# Altium project CAN_ESP.PrjPcb
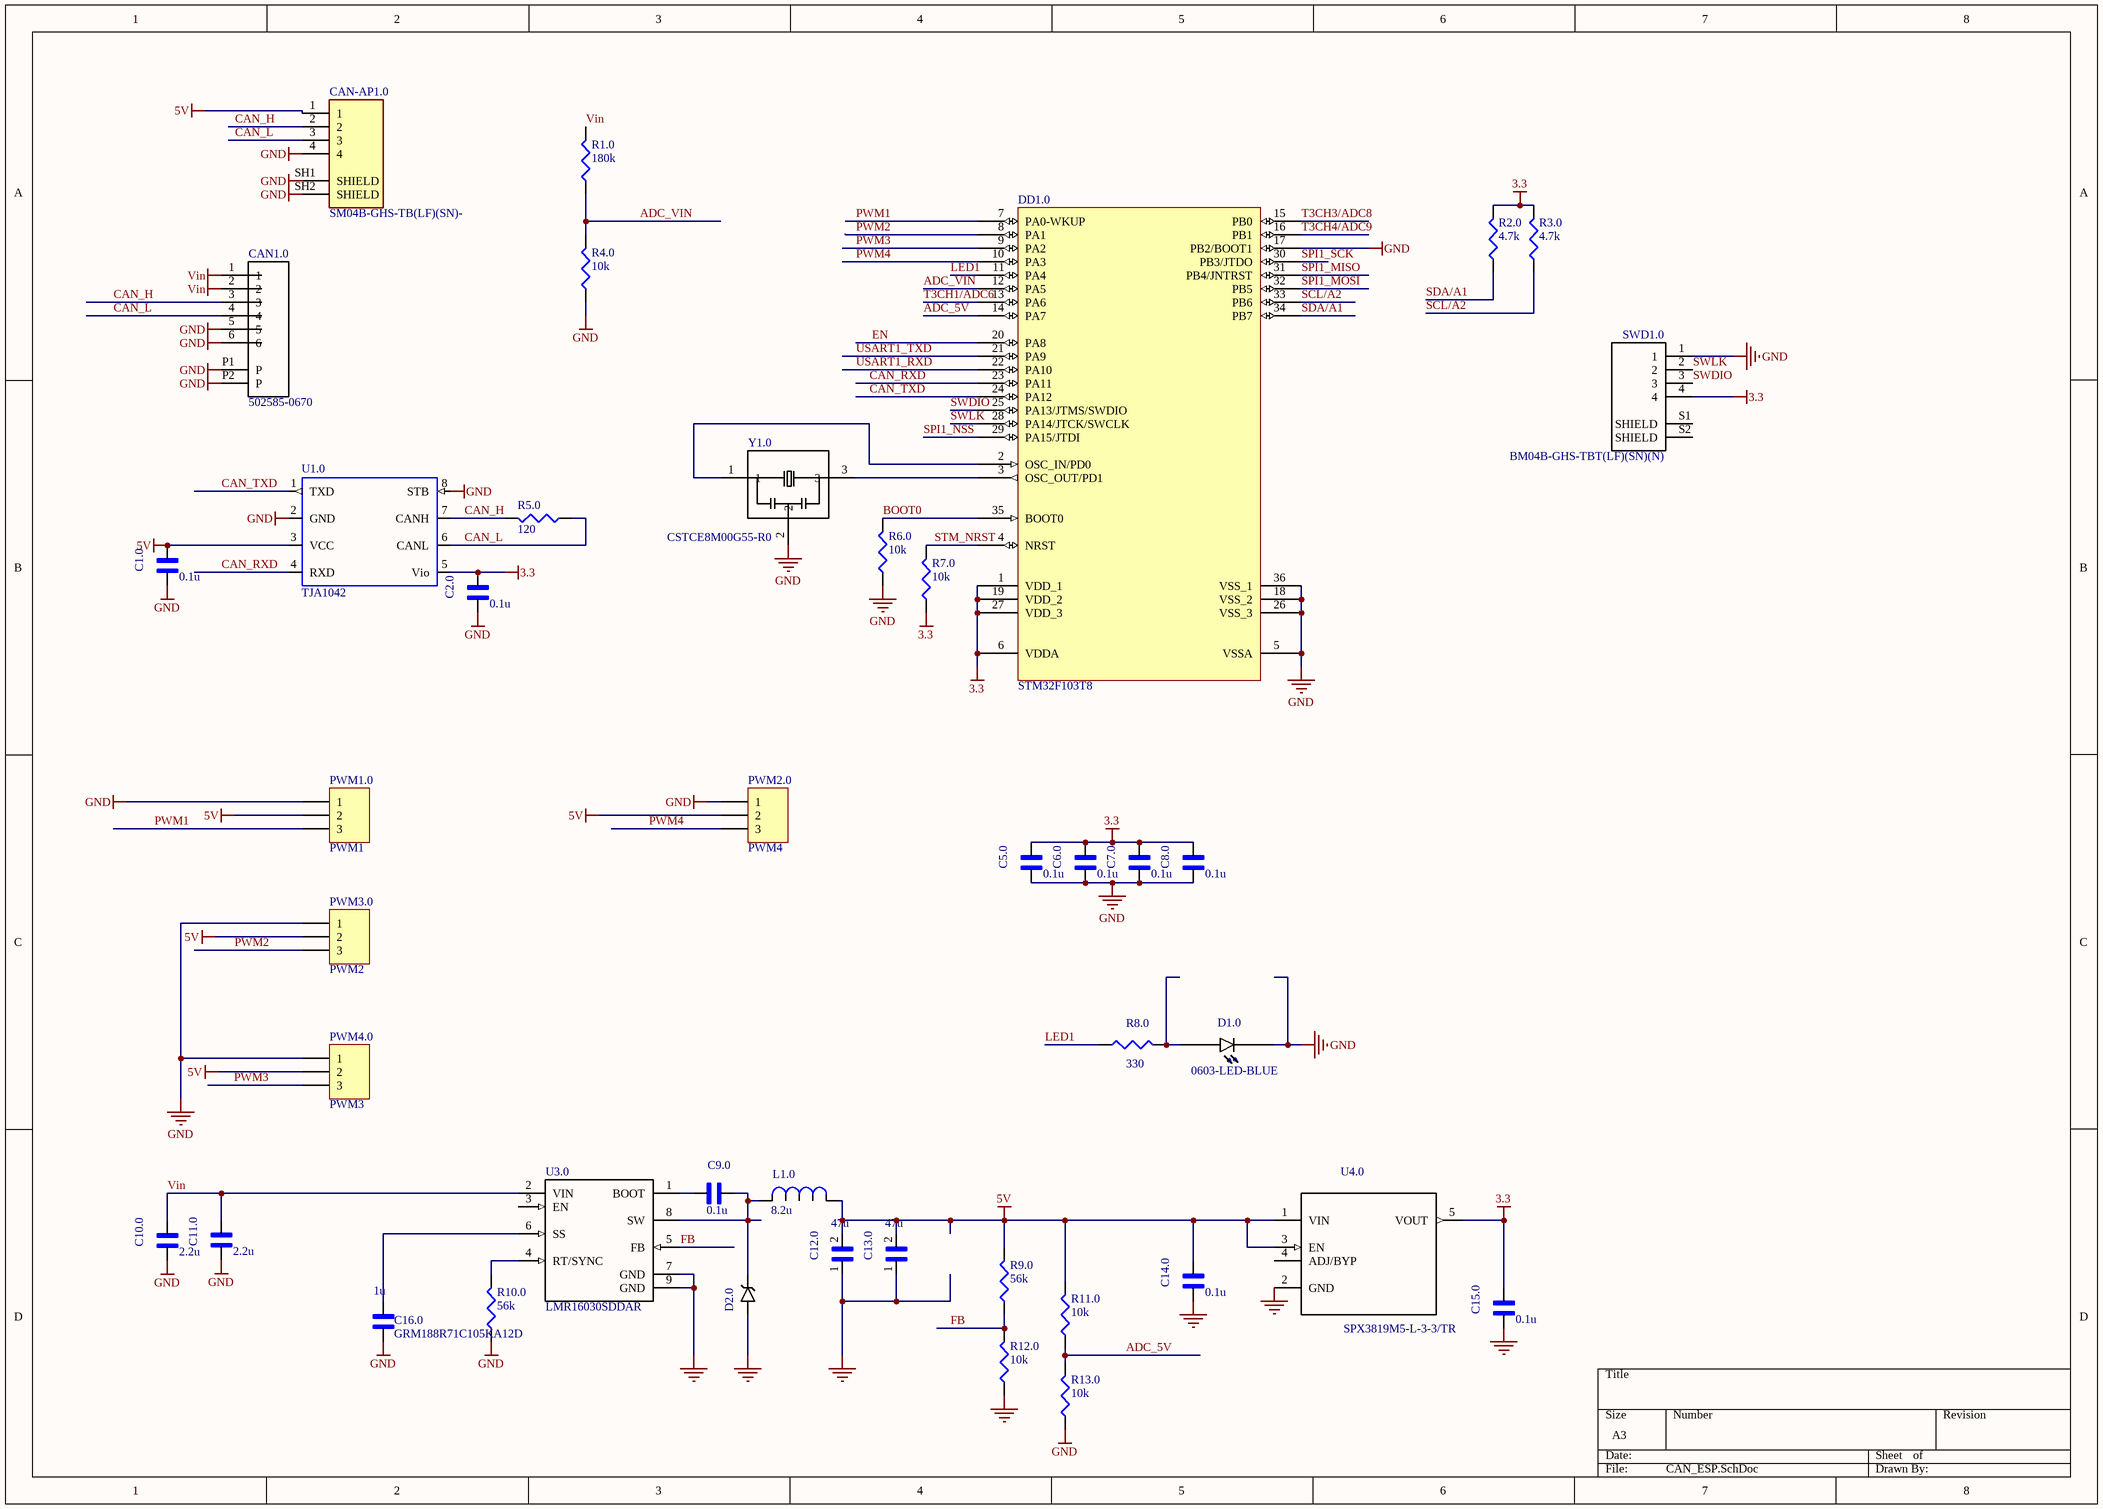
[diagram p0: CAN_ESP.SchDoc]
Version: 1; Quantity: 10
3 sheets, 81 parts. Net scope: global (net labels, ports and power ports of the same name join across sheets).
Board file: Copy of CAN_ESP.PcbDoc
Sheets:
  CAN_ESP.SchDoc
  ESP8266.SchDoc
  sESP.SchDoc

## Sheet CAN_ESP.SchDoc
size A3; Revision: 7

### Parts
C1.0  value 0.1u  [*CAPC1608X90]  (hidden comment: GX035C104MAT2-500)
C2.0  value 0.1u  [*CAPC1608X90]  (hidden comment: GX035C104MAT2-500)
C5.0  value 0.1u  [*CAPC1608X90]  (hidden comment: GX035C104MAT2-500)
C6.0  value 0.1u  [*CAPC1608X90]  (hidden comment: GX035C104MAT2-500)
C7.0  value 0.1u  [*CAPC1608X90]  (hidden comment: GX035C104MAT2-500)
C8.0  value 0.1u  [*CAPC1608X90]  (hidden comment: GX035C104MAT2-500)
C9.0  value 0.1u  [*CAPC1608X90]  (hidden comment: GX035C104MAT2-500)
C10.0  value 2.2u  [*CAP3216X125N]  (hidden comment: GRM31CR71H225KA88L)
C11.0  value 2.2u  [*CAP3216X125N]  (hidden comment: GRM31CR71H225KA88L)
C12.0  value 47u  [*CAPC3216X125N]  (hidden comment: GRM31CR61A476KE15L)
C13.0  value 47u  [*CAPC3216X125N]  (hidden comment: GRM31CR61A476KE15L)
C14.0  value 0.1u  [*CAPC1608X90]  (hidden comment: GX035C104MAT2-500)
C15.0  value 0.1u  [*CAPC1608X90]  (hidden comment: GX035C104MAT2-500)
C16.0  GRM188R71C105KA12D  value 1u  [CAPC1608X90N]
CAN1.0  502585-0670  [MOLEX_502585-0670]
CAN-AP1.0  SM04B-GHS-TB(LF)(SN)-  [JST_SM04B-GHS-TB(LF)(SN)-]
D1.0  0603-LED-BLUE  [*LEDM1608X80_LTE-C1906R-14(Primary)]
D2.0  SK56  [*SMB_P6SMB62AT3G(Primary)]  (value not drawn)
DD1.0  STM32F103T8  [*QFN50P600X600X100-37N]
L1.0  value 8.2u  [*IND_IHLP_2525_CZ]  (hidden comment: IHLP2525CZER8R2M01)
PWM1.0  PWM1  [HDR Side 3 pin]
PWM2.0  PWM4  [HDR Side 3 pin]
PWM3.0  PWM2  [HDR Side 3 pin]
PWM4.0  PWM3  [HDR Side 3 pin]
R1.0  value 180k  [J1-0603]  (hidden comment: Res3)
R2.0  value 4.7k  [J1-0603]  (hidden comment: Res3)
R3.0  value 4.7k  [J1-0603]  (hidden comment: Res3)
R4.0  value 10k  [J1-0603]  (hidden comment: Res3)
R5.0  value 120  [J1-0603]  (hidden comment: Res3)
R6.0  value 10k  [J1-0603]  (hidden comment: RC0603FR-0710KL)
R7.0  value 10k  [J1-0603]  (hidden comment: RC0603FR-0710KL)
R8.0  value 330  [J1-0603]  (hidden comment: Res3)
R9.0  value 56k  [J1-0603]  (hidden comment: Res3)
R10.0  value 56k  [J1-0603]  (hidden comment: Res3)
R11.0  value 10k  [J1-0603]  (hidden comment: RC0603FR-0710KL)
R12.0  value 10k  [J1-0603]  (hidden comment: RC0603FR-0710KL)
R13.0  value 10k  [J1-0603]  (hidden comment: RC0603FR-0710KL)
SWD1.0  BM04B-GHS-TBT(LF)(SN)(N)  [JST_BM04B-GHS-holes]
U1.0  TJA1042  [SOT782-1]
U3.0  LMR16030SDDAR  [*SOIC127P600X170-9N - duplicate]
U4.0  SPX3819M5-L-3-3/TR  [*SOT95P280X145-5N]
Y1.0  CSTCE8M00G55-R0  [*OSC_CSTCE8M00G55-R0]

### Nets
3.3: C2.0.1 C5.0.1 C6.0.1 C7.0.1 C8.0.1 C15.0.1 DD1.0.1(VDD_1) DD1.0.6(VDDA) DD1.0.19(VDD_2) DD1.0.27(VDD_3) R2.0.2 R3.0.2 R7.0.1 SWD1.0.4 U1.0.5(Vio) U4.0.5(VOUT)
5V: C1.0.1 C12.0.2 C13.0.2 C14.0.1 CAN-AP1.0.1 L1.0.1 PWM1.0.2 PWM2.0.2 PWM3.0.2 PWM4.0.2 R9.0.2 R11.0.2 U1.0.3(VCC) U4.0.1(VIN) U4.0.3(EN)
GND: C1.0.2 C2.0.2 C5.0.2 C6.0.2 C7.0.2 C8.0.2 C10.0.2 C11.0.2 C12.0.1 C13.0.1 C14.0.2 C15.0.2 C16.0.1 CAN1.0.5 CAN1.0.6 CAN1.0.P1(P) CAN1.0.P2(P) CAN-AP1.0.4 CAN-AP1.0.SH1(SHIELD) CAN-AP1.0.SH2(SHIELD) D1.0.C D2.0.A DD1.0.5(VSSA) DD1.0.17(PB2/BOOT1) DD1.0.18(VSS_2) DD1.0.26(VSS_3) DD1.0.36(VSS_1) PWM1.0.1 PWM2.0.1 PWM3.0.1 PWM4.0.1 R4.0.1 R6.0.1 R10.0.1 R12.0.1 R13.0.1 SWD1.0.1 U1.0.2(GND) U1.0.8(STB) U3.0.7(GND) U3.0.9(GND) U4.0.2(GND) Y1.0.2
Vin: C10.0.1 C11.0.1 CAN1.0.1 CAN1.0.2 R1.0.2 U3.0.2(VIN)
ADC_5V: DD1.0.14(PA7) R11.0.1 R13.0.2
ADC_VIN: DD1.0.12(PA5) R1.0.1 R4.0.2
BOOT0: DD1.0.35(BOOT0) R6.0.2
CAN_H: CAN1.0.3 CAN-AP1.0.2 R5.0.2 U1.0.7(CANH)
CAN_L: CAN1.0.4 CAN-AP1.0.3 R5.0.1 U1.0.6(CANL)
CAN_RXD: DD1.0.23(PA11) U1.0.4(RXD)
CAN_TXD: DD1.0.24(PA12) U1.0.1(TXD)
EN: DD1.0.20(PA8)
FB: R9.0.1 R12.0.2 U3.0.5(FB)
LED1: DD1.0.11(PA4) R8.0.1
PWM1: DD1.0.7(PA0-WKUP) PWM1.0.3
PWM2: DD1.0.8(PA1) PWM3.0.3
PWM3: DD1.0.9(PA2) PWM4.0.3
PWM4: DD1.0.10(PA3) PWM2.0.3
SCL/A2: DD1.0.33(PB6) R3.0.1
SDA/A1: DD1.0.34(PB7) R2.0.1
SPI1_MISO: DD1.0.31(PB4/JNTRST)
SPI1_MOSI: DD1.0.32(PB5)
SPI1_NSS: DD1.0.29(PA15/JTDI)
SPI1_SCK: DD1.0.30(PB3/JTDO)
STM_NRST: DD1.0.4(NRST) R7.0.2
SWDIO: DD1.0.25(PA13/JTMS/SWDIO) SWD1.0.3
SWLK: DD1.0.28(PA14/JTCK/SWCLK) SWD1.0.2
T3CH1/ADC6: DD1.0.13(PA6)
T3CH3/ADC8: DD1.0.15(PB0)
T3CH4/ADC9: DD1.0.16(PB1)
USART1_RXD: DD1.0.22(PA10)  [project net TXD0]
USART1_TXD: DD1.0.21(PA9)  [project net RXD0]
NetC9.0_1: C9.0.1 D2.0.C L1.0.2 U3.0.8(SW)
NetC9.0_2: C9.0.2 U3.0.1(BOOT)
NetC16.0_2: C16.0.2 U3.0.6(SS)
NetD1.0_A: D1.0.A R8.0.2
NetDD1.0_2: DD1.0.2(OSC_IN/PD0) Y1.0.1
NetDD1.0_3: DD1.0.3(OSC_OUT/PD1) Y1.0.3
NetR10.0_2: R10.0.2 U3.0.4(RT/SYNC)

Not connected (* = marked no-connect by the designer): SWD1.0 S1(SHIELD) S2(SHIELD); U3.0 3(EN); U4.0 4(ADJ/BYP)

### Library data of the parts
C1.0 C2.0 C5.0 C6.0 C7.0 C8.0 C9.0 = GX035C104MAT2-500: Cap Thin Film 0.1uf 50v 0603; MF: AVX; MP: GX035C104MAT2-500 or CL10B104JB8NNNC; Pacage Metric: 1608; Type: SMD; Package: 0603 AVX; SnapEDA_Link: https://www.snapeda.com/parts/GX035C104MAT2-500/AVX/view-part/?ref=snap
C10.0 C11.0 = GRM31CR71H225KA88L: / 1206 2.2 uF 50 V В±10% Tolerance X7R SMT Multilayer Ceramic Capacitor /; MF: Murata Electronics; Type: SMD; Package: 1206 Murata; SnapEDA_Link: https://www.snapeda.com/parts/GRM31CR71H225KA88L/Murata%20Electronics%20North%20America/view-part/?ref=snap; MP: GRM31CR71H225KA88L
C12.0 C13.0 = GRM31CR61A476KE15L: Multilayer Ceramic Capacitor, GRM Series, 47 - F, - 10%, X5R, 10 V, 1206 [3216 Metric]; MF: Murata Electronics; Type: SMD; Package: 1206 Murata Electronics; MP: GRM31CR61A476KE15L; SnapEDA_Link: https://www.snapeda.com/parts/GRM31CR61A476KE15L/Murata%20Electronics%20North%20America/view-part/?ref=snap
C14.0 C15.0 = GX035C104MAT2-500: Cap Thin Film 0.1uf 50v 0603; MF: AVX; Pacage Metric: 1608; Type: SMD; Package: 0603 AVX; MP: GX035C104MAT2-500; SnapEDA_Link: https://www.snapeda.com/parts/GX035C104MAT2-500/AVX/view-part/?ref=snap
C16.0 = GRM188R71C105KA12D: SMD Capacitor X7R(EIA) with Capacitance: 1.0uF Tol. 10%. Rated Voltage: 16Vdc; MF: Murata Electronics; Pacage Metric: 1608; MP: GRM188R71C105KA12D; SnapEDA_Link: https://www.snapeda.com/parts/GRM188R71C105KA12D/Murata%20Electronics%20North%20America/view-part/228340/?ref=snap; Package: 0603; ChipDip_Link: https://www.chipdip.ru/product/grm188r71c105ka12d; HelpURL: https://static.chipdip.ru/lib/428/DOC005428493.pdf; Type: SMD
CAN1.0 = 502585-0670: 1.50mm Pitch, CLIK-Mate PCB Receptacle, Single Row, Surface Mount, Right-Angle, Tin Plating, Positive Lock, 6 Circuits, Natural; MF: Molex; System: Connector; MP: 502585-0670; Package: None; SnapEDA_Link: https://www.snapeda.com/parts/502494-0670/Molex/view-part/?ref=snap; Value: *; Type: SMD
CAN-AP1.0 = SM04B-GHS-TB(LF)(SN)-: Connector Header Surface Mount, Right Angle 4 position 0.049 _1.25mm_; MF: JST Sales; MP: SM04B-GHS-TB(LF)(SN); Package: None; Value: *; SnapEDA_Link: https://www.snapeda.com/parts/SM04B-GHS-TB%28LF%29%28SN%29-/JST%20Sales%20America%20Inc./view-part/2759740/?ref=snap; HelpURL: http://www.farnell.com/datasheets/2082975.pdf; System: Connector; ChipDip_Link: https://www.chipdip.ru/product/sm04b-ghs-tb-lf-sn-gh-1.25mm-header-side-ent
D1.0 = LTE-C1906R-14: LED IrLED Chip LED 2-Pin SMD T/R; Package: 0603 Lite-On; MP: 0603-LED-BLUE; SnapEDA_Link: https://www.snapeda.com/parts/LTE-C1906R-14/Lite-On%20Inc./view-part/?ref=snap; Value: *; Type: SMD
D2.0 = SK56: Диод Шоттки 5А 60В [SMB / DO-214AA]; MF: Littelfuse Inc.; Type: SMD; MP: SK56; Package: DO-214 Littelfuse; SnapEDA_Link: https://www.snapeda.com/parts/P6SMB62AT3G/Littelfuse%20Inc./view-part/?ref=snap; Value: *; ChipDip_Link: https://www.chipdip.ru/product/sk56
DD1.0 = STM32F103T8: STM32F103T8U6, Микроконтроллер 32BIT ARM 64K FLASH [VFQFPN-36]; MF: STM; ChipDip_Link: https://www.chipdip.ru/product/stm32f103t8u6-2; HelpURL: http://www.st.com/stonline/products/literature/ds/13587.pdf; MP: STM32F103T8U6; Package: VFQFPN-36; SnapEDA_Link: https://www.snapeda.com/parts/STM32F103T8U6TR/STMicroelectronics/view-part/?ref=search&t=STM32F103T8U6; Type: SMD
L1.0 = IHLP2525CZER8R2M01: IHLP2525CZER8R2M01, 8.2uH 4A 20% Low Profile High Current SMT Inductor, Индуктивность; MF: Vishay Dale; Price: None; Availability: Unavailable; SnapEDA_Link: https://www.snapeda.com/parts/IHLP2525CZER100M01/Vishay%20Dale/view-part/?ref=snap; MP: IHLP2525CZER8R2M01; Package: Nonstandard Vishay
PWM1.0 PWM2.0 PWM3.0 PWM4.0 = Header 3: Header, 4-Pin; System: Connector; MF: Connfly electronic (Zhenqin); MP: PLS-3 (DS1021-1x3); Type: SMD; ChipDip_Link: https://www.chipdip.ru/product/pls-3; HelpURL: https://static.chipdip.ru/lib/227/DOC000227157.pdf
R1.0 = Res3: Resistor; Pacage Metric: 1608; MP: 180K 1% 0603; Package: R0603; Type: SMD
R2.0 R3.0 = Res3: Resistor; Pacage Metric: 1608; MP: 4.7K 1% 0603; ChipDip_Link: https://www.chipdip.ru/product0/9000079736; HelpURL: https://www.chipdip.ru/product0/9000079736; Package: R0603; Type: SMD
R4.0 = Res3: Resistor; Pacage Metric: 1608; MP: 10K 1% 0603; ChipDip_Link: https://www.chipdip.ru/product0/9000079736; HelpURL: https://www.chipdip.ru/product0/9000079736; Package: R0603; Type: SMD
R5.0 = Res3: 120 Ohms 1 0.1 W 1 10 W Chip Resistor 0603 1608 Metric Thick Film; Pacage Metric: 1608; MP: RC0603FR-07120RL; ChipDip_Link: https://www.chipdip.ru/product0/9000079618; HelpURL: https://www.chipdip.ru/product0/9000079618; Package: R0603; Type: SMD
R6.0 R7.0 R11.0 R12.0 R13.0 = RC0603FR-0710KL: 10 kOhms 1 0.1 W 1 10 W Chip Resistor 0603 1608 Metric Thick Film; Pacage Metric: 1608; MF: Yageo or NXP; MP: 10K 1% 0603; ChipDip_Link: https://www.chipdip.ru/product0/9000079736; HelpURL: https://www.chipdip.ru/product0/9000079736; Package: R0603; Type: SMD; SnapEDA_Link: https://www.snapeda.com/parts/RC0603FR-0710KL/Yageo/view-part/?ref=dk&t=RC0603FR-0710KL&con_ref=None
R8.0 = Res3: Resistor; Pacage Metric: 1608; MP: RC0603FR-07330RL; ChipDip_Link: https://www.chipdip.ru/product0/9000079628; HelpURL: https://www.chipdip.ru/product0/9000079628; Package: R0603; Type: SMD
R9.0 R10.0 = Res3: Resistor; Pacage Metric: 1608; MP: RC0603FR-0756KL; ChipDip_Link: https://www.chipdip.ru/product0/9000079754; HelpURL: https://www.chipdip.ru/product0/9000079754; Package: R0603; Type: SMD
SWD1.0 = BM04B-GHS-TBT(LF)(SN)(N): Conn Shrouded Header HDR 4 POS 1.25mm Solder ST SMD Reel; MF: JST Sales; MP: SM04B-GHS-TB(LF)(SN); Instructions: Do not install; System: Connector; SnapEDA_Link: https://www.snapeda.com/parts/BM04B-GHS-TBT%28LF%29%28SN%29%28N%29/JST%20Sales%20America%20Inc./view-part/?ref=snap; Package: None; Value: *; Type: SMD
U1.0 = TJA1042: 1/1 Transceiver Half CANbus 8-SO; MF: NXP USA; SnapEDA_Link: https://www.snapeda.com/parts/TJA1042/NXP%20USA%20Inc./view-part/900919/?ref=snap; Value: *; MP: TJA1042; Package: VDFN-8 NXP USA; ChipDip_Link: https://www.chipdip.ru/product1/8002840332; HelpURL: https://static.chipdip.ru/lib/583/DOC001583059.pdf; Type: SMD
U3.0 = LMR16030SDDAR: LMR16030SDDAR, Conv DC-DC 4.3V to 60V Step Down Single-Out 1V to 50V 3A Automotive 8-Pin HSOP EP T/R; MF: Texas Instruments; SnapEDA_Link: https://www.snapeda.com/parts/TPS54560DDA/Texas%20Instruments/view-part/?ref=snap; MP: LMR16030SDDAR; Package: PowerSOIC-8 Texas Instruments; Value: *; Type: SMD; ChipDip_Link: https://www.chipdip.ru/product1/8003448566; HelpURL: https://www.ti.com/lit/ds/symlink/lmr16030.pdf
U4.0 = SPX3819M5-L: Low Dropout Voltage Regulator, Adjustable 0.5A, В±1%, 2.5 to 16 Vin, 5-Pin SOT-23 /; MF: MaxLinear, Inc.; Value: 3V3; MP: SPX3819M5-L-3-3/TR; Package: SOT-23-5 Exar; SnapEDA_Link: https://www.snapeda.com/parts/SPX3819M5-L/MaxLinear%2C%20Inc./view-part/?ref=snap; Type: SMD; ChipDip_Link: https://www.chipdip.ru/product1/8003455237; HelpURL: http://www.farnell.com/datasheets/2614478.pdf
Y1.0 = CSTCE8M00G55-R0: Ceramic Resonator 8MHz ??0.5% _Tol_ ??0.2% _Stability_ 33pF 40Ohm 3-Pin CSMD T/R; MF: Murata; MP: CSTCE8M00G55-R0; Package: SMD-3 Murata; SnapEDA_Link: https://www.snapeda.com/parts/CSTCE8M00G55-R0/Murata%20Electronics%20North%20America/view-part/?ref=snap; Value: *; ChipDip_Link: https://www.chipdip.ru/product1/8001783721; HelpURL: https://www.murata.com/en-eu/api/pdfdownloadapi?cate=&partno=CSTCE8M00G55-R0; Type: SMD

## Sheet ESP8266.SchDoc
size A3; Revision: 7
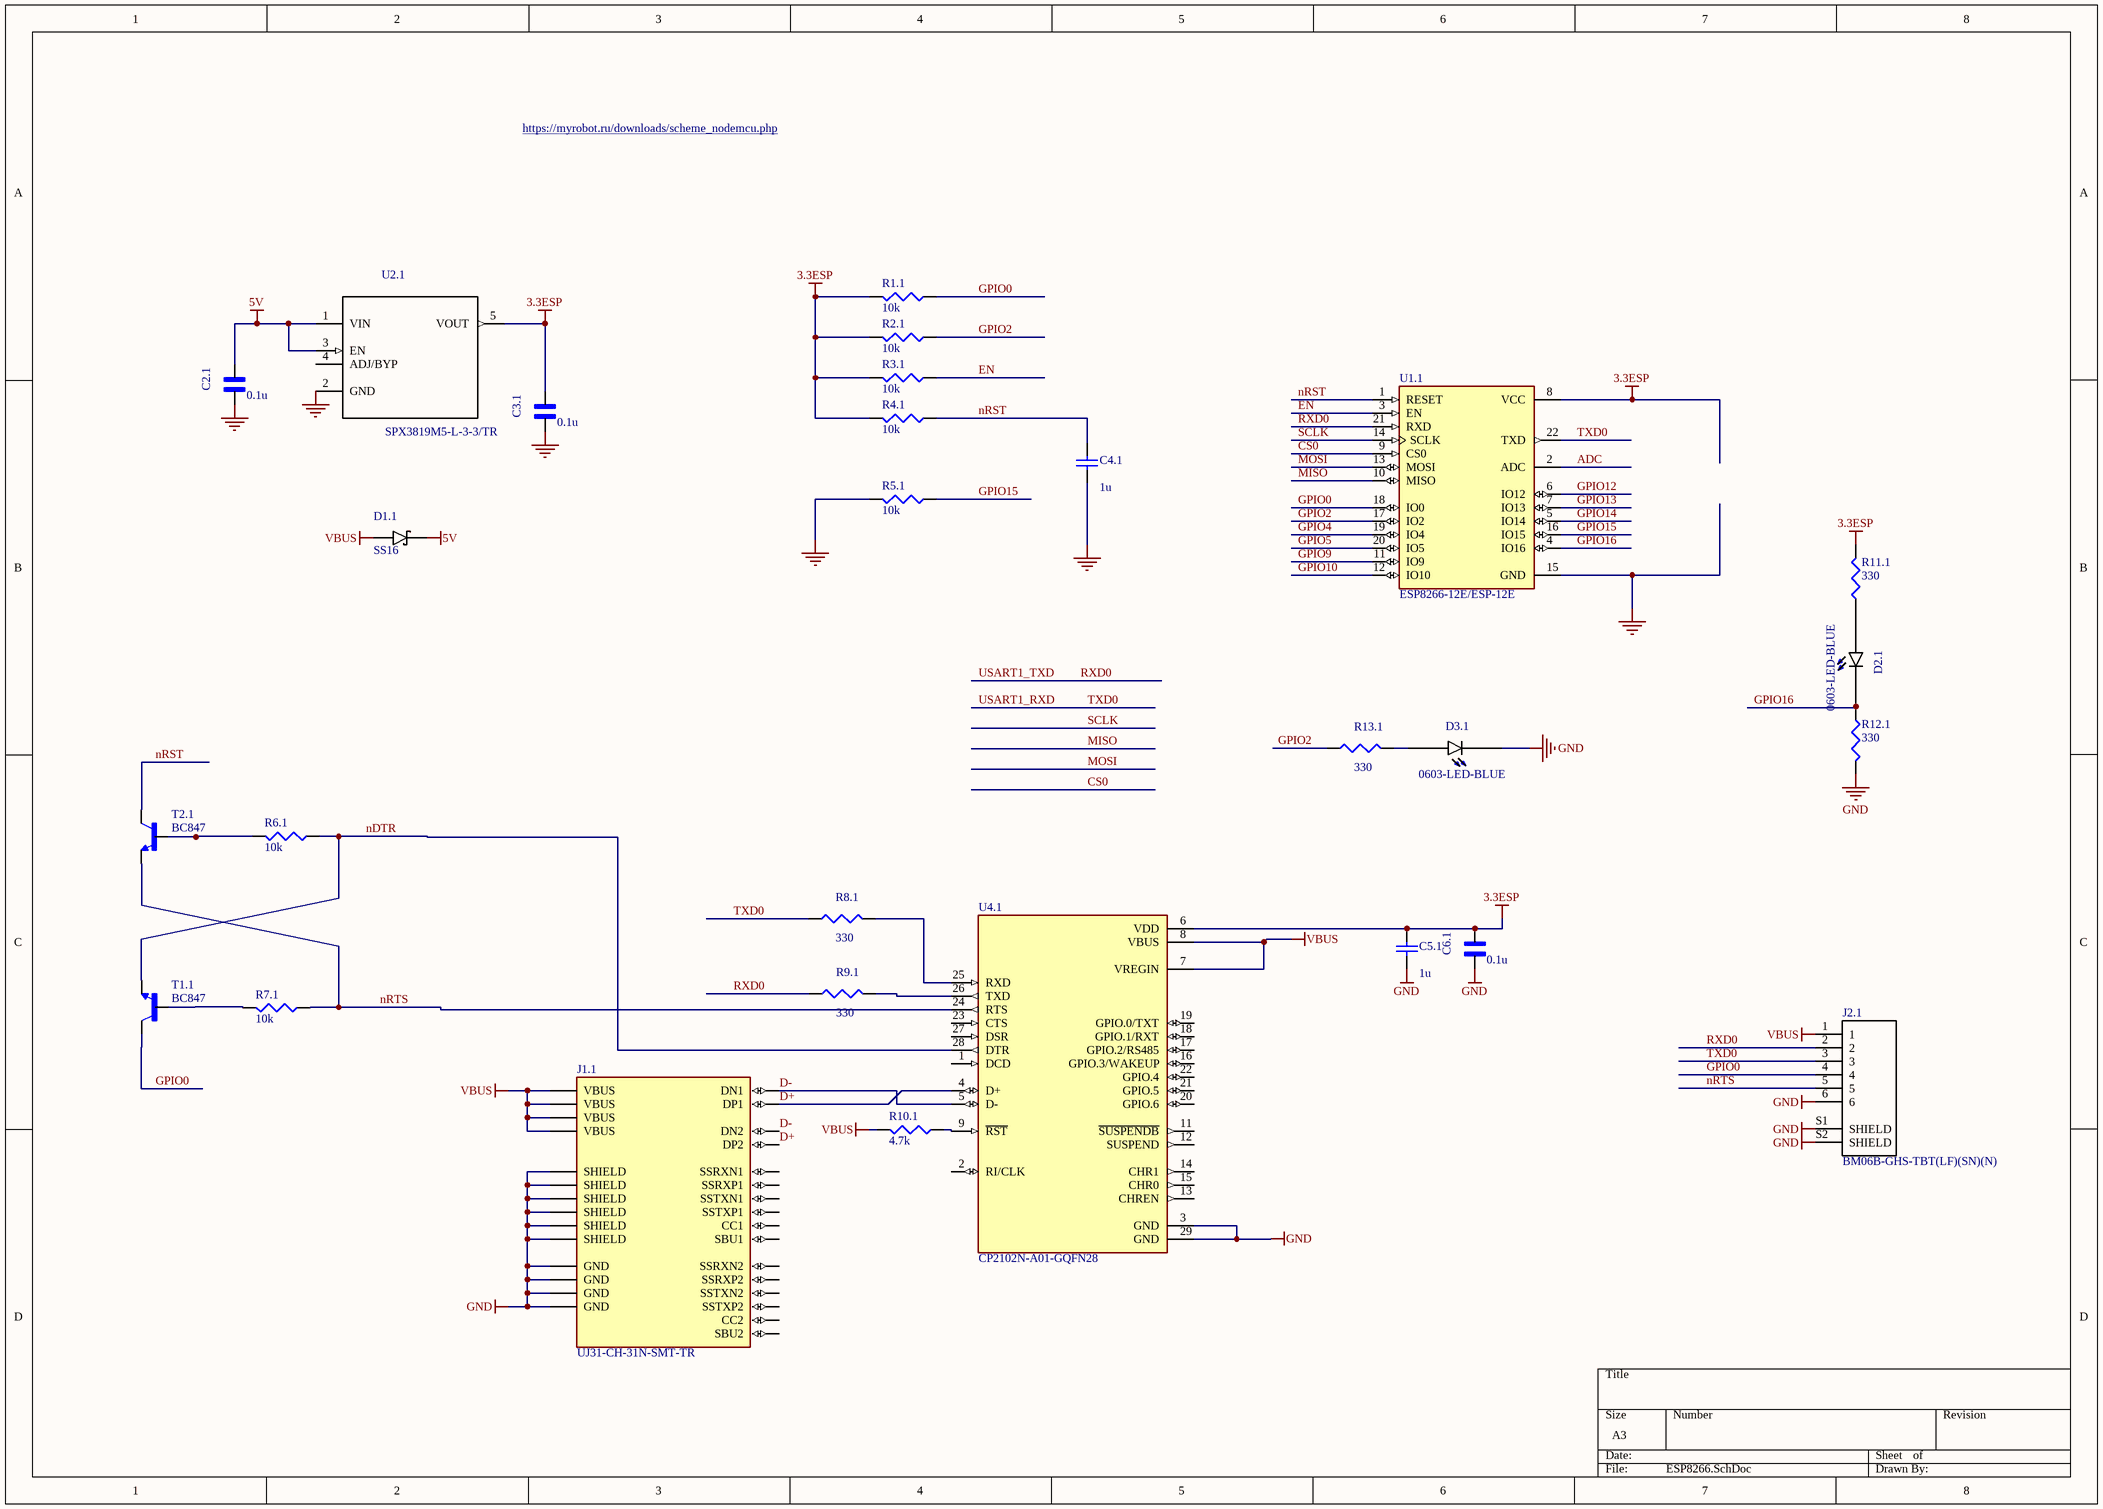
[diagram p1: ESP8266.SchDoc]

### Parts
C2.1  value 0.1u  [*CAPC1608X90]  (hidden comment: GX035C104MAT2-500)
C3.1  value 0.1u  [*CAPC1608X90]  (hidden comment: GX035C104MAT2-500)
C4.1  value 1u  [1608[0603]]  (hidden comment: Cap Semi)
C5.1  value 1u  [1608[0603]]  (hidden comment: Cap Semi)
C6.1  value 0.1u  [*CAPC1608X90]  (hidden comment: GX035C104MAT2-500)
D1.1  SS16  [*DIOM5227X250N_SS16(Primary)]
D2.1  0603-LED-BLUE  [*LEDM1608X80_LTE-C1906R-14(Primary)]
D3.1  0603-LED-BLUE  [*LEDM1608X80_LTE-C1906R-14(Primary)]
J1.1  UJ31-CH-31N-SMT-TR  [CUI_UJ31-CH-31N-SMT-TR]
J2.1  BM06B-GHS-TBT(LF)(SN)(N)  [*JST_BM06B-GHS-TBT(LF)(SN)(N)_BM06B-GHS-TBT(LF)(SN)(N)(Primary)]
R1.1  value 10k  [J1-0603]  (hidden comment: Res3)
R2.1  value 10k  [J1-0603]  (hidden comment: Res3)
R3.1  value 10k  [J1-0603]  (hidden comment: Res3)
R4.1  value 10k  [J1-0603]  (hidden comment: Res3)
R5.1  value 10k  [J1-0603]  (hidden comment: Res3)
R6.1  value 10k  [J1-0603]  (hidden comment: Res3)
R7.1  value 10k  [J1-0603]  (hidden comment: Res3)
R8.1  value 330  [J1-0603]  (hidden comment: Res3)
R9.1  value 330  [J1-0603]  (hidden comment: Res3)
R10.1  value 4.7k  [J1-0603]  (hidden comment: Res3)
R11.1  value 330  [J1-0603]  (hidden comment: Res3)
R12.1  value 330  [J1-0603]  (hidden comment: Res3)
R13.1  value 330  [J1-0603]  (hidden comment: Res3)
T1.1  BC847  [SOT23]
T2.1  BC847  [SOT23]
U1.1  ESP8266-12E/ESP-12E  [XCVR_ESP8266-12E/ESP-12E]
U2.1  SPX3819M5-L-3-3/TR  [*SOT95P280X145-5N]
U4.1  CP2102N-A01-GQFN28  [QFN50P500X500X80-29N]

### Nets
3.3ESP: C3.1.1 C5.1.1 C6.1.1 R1.1.2 R2.1.2 R3.1.2 R4.1.2 R11.1.2 U1.1.8(VCC) U2.1.5(VOUT) U4.1.6(VDD)
5V: C2.1.1 D1.1.C(K) U2.1.1(VIN) U2.1.3(EN)
GND: C2.1.2 C3.1.2 C4.1.2 C5.1.2 C6.1.2 D3.1.C J1.1.A1(GND) J1.1.A12(GND) J1.1.B1(GND) J1.1.B12(GND) J1.1.SH1(SHIELD) J1.1.SH2(SHIELD) J1.1.SH3(SHIELD) J1.1.SH4(SHIELD) J1.1.SH5(SHIELD) J1.1.SH6(SHIELD) J2.1.6 J2.1.S1(SHIELD) J2.1.S2(SHIELD) R5.1.2 R12.1.2 U1.1.15(GND) U2.1.2(GND) U4.1.3(GND) U4.1.29(GND)
VBUS: D1.1.A J1.1.A4(VBUS) J1.1.A9(VBUS) J1.1.B4(VBUS) J1.1.B9(VBUS) J2.1.1 R10.1.2 U4.1.7(VREGIN) U4.1.8(VBUS)
ADC: U1.1.2(ADC)
CS0: U1.1.9(CS0)
D+: J1.1.A6(DP1) J1.1.B6(DP2) U4.1.4(D+)
D-: J1.1.A7(DN1) J1.1.B7(DN2) U4.1.5(D-)
EN: R3.1.1 U1.1.3(EN)
GPIO0: J2.1.4 R1.1.1 T1.1.3(C) U1.1.18(IO0)
GPIO2: R2.1.1 R13.1.1 U1.1.17(IO2)
GPIO4: U1.1.19(IO4)
GPIO5: U1.1.20(IO5)
GPIO9: U1.1.11(IO9)
GPIO10: U1.1.12(IO10)
GPIO12: U1.1.6(IO12)
GPIO13: U1.1.7(IO13)
GPIO14: U1.1.5(IO14)
GPIO15: R5.1.1 U1.1.16(IO15)
GPIO16: D2.1.C R12.1.1 U1.1.4(IO16)
MISO: U1.1.10(MISO)
MOSI: U1.1.13(MOSI)
nDTR: R6.1.1 T1.1.2(E) U4.1.28(DTR)
nRST: C4.1.1 R4.1.1 T2.1.3(C) U1.1.1(RESET)
nRTS: J2.1.5 R7.1.1 T2.1.2(E) U4.1.24(RTS)
RXD0: J2.1.2 R9.1.1 U1.1.21(RXD)  [also labelled USART1_TXD]
SCLK: U1.1.14(SCLK)
TXD0: J2.1.3 R8.1.1 U1.1.22(TXD)  [also labelled USART1_RXD]
NetD2.1_A: D2.1.A R11.1.1
NetD3.1_A: D3.1.A R13.1.2
NetR6.1_2: R6.1.2 T2.1.1(B)
NetR7.1_2: R7.1.2 T1.1.1(B)
NetR8.1_2: R8.1.2 U4.1.25(RXD)
NetR9.1_2: R9.1.2 U4.1.26(TXD)
NetR10.1_1: R10.1.1 U4.1.9(~{RST})

Not connected (* = marked no-connect by the designer): J1.1 A2(SSTXP1) A3(SSTXN1) A5(CC1) A8(SBU1) A10(SSRXN2) A11(SSRXP2) B2(SSTXP2) B3(SSTXN2) B5(CC2) B8(SBU2) B10(SSRXN1) B11(SSRXP1); U2.1 4(ADJ/BYP); U4.1 1(DCD) 2(RI/CLK) 11(~{SUSPENDB}) 12(SUSPEND) 13(CHREN) 14(CHR1) 15(CHR0) 16(GPIO.3/WAKEUP) 17(GPIO.2/RS485) 18(GPIO.1/RXT) 19(GPIO.0/TXT) 20(GPIO.6) 21(GPIO.5) 22(GPIO.4) 23(CTS) 27(DSR)

### Notes on the sheet
- https://myrobot.ru/downloads/scheme_nodemcu.php

### Library data of the parts
C2.1 C3.1 = GX035C104MAT2-500: as C14.0 on sheet CAN_ESP; Package: 0603 AVX; MP: GX035C104MAT2-500; SnapEDA_Link: https://www.snapeda.com/parts/GX035C104MAT2-500/AVX/view-part/?ref=snap
C4.1 C5.1 = Cap Semi: Capacitor (Semiconductor SIM Model); Published: 8-Jun-2000; LatestRevisionDate: 29-May-2009; LatestRevisionNote: IPC-7351 Footprint Added.; PackageReference: C1206; Publisher: Altium Limited; PackageDescription: Chip Capacitor
C6.1 = GX035C104MAT2-500: as C1.0 on sheet CAN_ESP; Package: 0603 AVX; SnapEDA_Link: https://www.snapeda.com/parts/GX035C104MAT2-500/AVX/view-part/?ref=snap
D1.1 = SS16: Diode Schottky 60V 1A Surface Mount SMA; Type: SMD; SnapEDA_Link: https://www.snapeda.com/parts/SS16/ON%20Semiconductor/view-part/?ref=search&t=ss16; Value: *; ChipDip_Link: https://www.chipdip.ru/product/ss16; MP: SS16; Package: SMA-2
D2.1 D3.1 = LTE-C1906R-14: LED IrLED Chip LED 2-Pin SMD T/R; Package: 0603 Lite-On; MP: 0603-LED-BLUE; SnapEDA_Link: https://www.snapeda.com/parts/LTE-C1906R-14/Lite-On%20Inc./view-part/?ref=snap; Value: *; Type: SMD
J1.1 = UJ31-CH-31N-SMT-TR: Type C, USB 3.1 Gen 2, 5 A, Right Angle, Surface Mount _SMT_, USB Receptacle; MF: CUI Devices; Value: *; SnapEDA_Link: https://www.snapeda.com/parts/UJ31-CH-31N-SMT-TR/CUI%20Devices/view-part/2776725/?ref=snap; Availability: Unavailable; Price: None; Package: None; MP: UJ31-CH-31N-SMT-TR; ChipDip_Link: https://www.chipdip.ru/product1/8002862225; HelpURL: https://www.chipdip.ru/product1/8002862225
J2.1 = BM06B-GHS-TBT(LF)(SN)(N): Conn Header Gh Top 6pos 1.25mm; MP: BM06B-GHS-TBT_LF__SN__N_; MF: JST Sales; Package: None; Availability: Unavailable; SnapEDA_Link: https://www.snapeda.com/parts/BM06B-GHS-TBT%28LF%29%28SN%29%28N%29/JST%20Sales%20America%20Inc./view-part/?ref=snap; Price: None; Value: *
R1.1 R2.1 R3.1 R4.1 R5.1 R6.1 R7.1 = Res3: as R4.0 on sheet CAN_ESP; ChipDip_Link: https://www.chipdip.ru/product0/9000079736; HelpURL: https://www.chipdip.ru/product0/9000079736; Package: R0603; Type: SMD
R8.1 R9.1 R11.1 R12.1 R13.1 = Res3: as R8.0 on sheet CAN_ESP; ChipDip_Link: https://www.chipdip.ru/product0/9000079628; HelpURL: https://www.chipdip.ru/product0/9000079628; Package: R0603; Type: SMD
R10.1 = Res3: as R2.0 on sheet CAN_ESP; ChipDip_Link: https://www.chipdip.ru/product0/9000079736; HelpURL: https://www.chipdip.ru/product0/9000079736; Package: R0603; Type: SMD
T1.1 T2.1 = BC847: <b>NPN TRANSISTOR</b>; MF: {'manufacturer': u'Rectron'}; Package: None; MP: BC847; Value: *; Availability: Unavailable; Price: None
U1.1 = ESP8266-12E/ESP-12E: ESP-12E WiFi Module; MF: {'manufacturer': u'AI-Thinker'}; Price: None; MP: ESP8266-12E/ESP-12E; Availability: Unavailable; Value: *; Package: None
U2.1 = SPX3819M5-L: as U4.0 on sheet CAN_ESP; MP: SPX3819M5-L-3-3/TR; Package: SOT-23-5 Exar; SnapEDA_Link: https://www.snapeda.com/parts/SPX3819M5-L/MaxLinear%2C%20Inc./view-part/?ref=snap; Type: SMD; ChipDip_Link: https://www.chipdip.ru/product1/8003455237; HelpURL: http://www.farnell.com/datasheets/2614478.pdf
U4.1 = CP2102N-A01-GQFN28: Ic Bridge Usb To Uart 28qfn; MF: {'manufacturer': u'Silicon Labs'}; MP: CP2102N-A01-GQFN28; Value: *; Package: None; Price: None; Availability: Unavailable

## Sheet sESP.SchDoc
size A3; Revision: 7
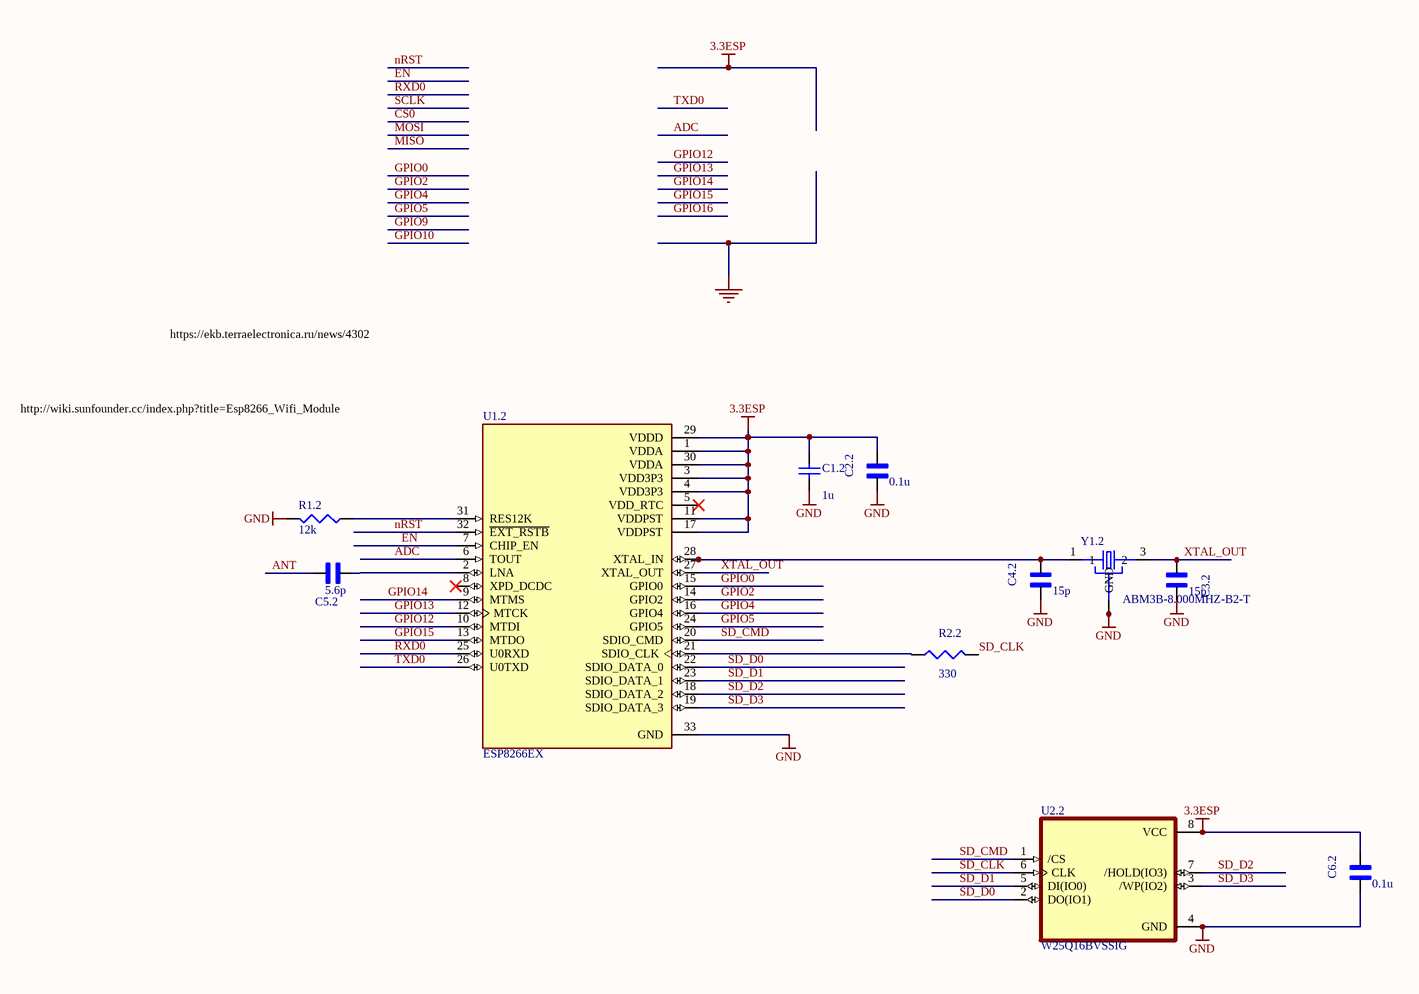
[diagram p2: sESP.SchDoc]

### Parts
C1.2  value 1u  [1608[0603]]  (hidden comment: Cap Semi)
C2.2  value 0.1u  [*CAPC1608X90]  (hidden comment: GX035C104MAT2-500)
C3.2  value 15p  [*CAPC1608X90N]  (hidden comment: GRM1885C2A150JA01J)
C4.2  value 15p  [*CAPC1608X90N]  (hidden comment: GRM1885C2A150JA01J)
C5.2  value 5.6p  [*CAPC1608X90]  (hidden comment: GX035C104MAT2-500)
C6.2  value 0.1u  [*CAPC1608X90]  (hidden comment: GX035C104MAT2-500)
R1.2  value 12k  [J1-0603]  (hidden comment: RC0603FR-0710KL)
R2.2  value 330  [J1-0603]  (hidden comment: Res3)
U1.2  ESP8266EX  [QFN50P500X500X80-33N]
U2.2  W25Q16BVSSIG  [SOIC127P790X216-8N]
Y1.2  ABM3B-8.000MHZ-B2-T  [OSCSC500X320X110-4N]

### Nets
3.3ESP: C1.2.1 C2.2.1 C6.2.1 U1.2.1(VDDA) U1.2.3(VDD3P3) U1.2.4(VDD3P3) U1.2.11(VDDPST) U1.2.17(VDDPST) U1.2.29(VDDD) U1.2.30(VDDA) U2.2.8(VCC)
GND: C1.2.2 C2.2.2 C3.2.2 C4.2.1 C6.2.2 R1.2.2 U1.2.33(GND) U2.2.4(GND) Y1.2.2(GND) Y1.2.4(GND)
ADC: U1.2.6(TOUT)
ANT: C5.2.1
EN: U1.2.7(CHIP_EN)
GPIO0: U1.2.15(GPIO0)
GPIO2: U1.2.14(GPIO2)
GPIO4: U1.2.16(GPIO4)
GPIO5: U1.2.24(GPIO5)
GPIO12: U1.2.10(MTDI)
GPIO13: U1.2.12(MTCK)
GPIO14: U1.2.9(MTMS)
GPIO15: U1.2.13(MTDO)
nRST: U1.2.32(~{EXT_RSTB})
RXD0: U1.2.25(U0RXD)
SD_CLK: R2.2.2 U2.2.6(CLK)
SD_CMD: U1.2.20(SDIO_CMD) U2.2.1(/CS)
SD_D0: U1.2.22(SDIO_DATA_0) U2.2.2(DO(IO1))
SD_D1: U1.2.23(SDIO_DATA_1) U2.2.5(DI(IO0))
SD_D2: U1.2.18(SDIO_DATA_2) U2.2.7(/HOLD(IO3))
SD_D3: U1.2.19(SDIO_DATA_3) U2.2.3(/WP(IO2))
TXD0: U1.2.26(U0TXD)
XTAL_OUT: C3.2.1 U1.2.27(XTAL_OUT) Y1.2.3(2)
NetC4.2_2: C4.2.2 U1.2.28(XTAL_IN) Y1.2.1
NetC5.2_2: C5.2.2 U1.2.2(LNA)
NetR1.2_1: R1.2.1 U1.2.31(RES12K)
NetR2.2_1: R2.2.1 U1.2.21(SDIO_CLK)

Not connected (* = marked no-connect by the designer): U1.2 5(VDD_RTC)* 8(XPD_DCDC)*

### Notes on the sheet
- https://ekb.terraelectronica.ru/news/4302
- http://wiki.sunfounder.cc/index.php?title=Esp8266_Wifi_Module

### Library data of the parts
C1.2 = Cap Semi: Capacitor (Semiconductor SIM Model); Published: 8-Jun-2000; LatestRevisionDate: 29-May-2009; LatestRevisionNote: IPC-7351 Footprint Added.; PackageReference: C1206; Publisher: Altium Limited; PackageDescription: Chip Capacitor
C2.2 C5.2 C6.2 = GX035C104MAT2-500: as C1.0 on sheet CAN_ESP; Package: 0603 AVX; SnapEDA_Link: https://www.snapeda.com/parts/GX035C104MAT2-500/AVX/view-part/?ref=snap
R1.2 = RC0603FR-0710KL: as R6.0 on sheet CAN_ESP; ChipDip_Link: https://www.chipdip.ru/product0/9000079736; HelpURL: https://www.chipdip.ru/product0/9000079736; Package: R0603; Type: SMD; SnapEDA_Link: https://www.snapeda.com/parts/RC0603FR-0710KL/Yageo/view-part/?ref=dk&t=RC0603FR-0710KL&con_ref=None
R2.2 = Res3: as R8.0 on sheet CAN_ESP; ChipDip_Link: https://www.chipdip.ru/product0/9000079628; HelpURL: https://www.chipdip.ru/product0/9000079628; Package: R0603; Type: SMD
U1.2 = ESP8266EX: IC RF TxRx + MCU WiFi 802.11b/g/n 2.4GHz 32-VFQFN Exposed Pad; MF: Espressif Systems; SnapEDA_Link: https://www.snapeda.com/parts/ESP8266EX/Espressif%20Systems/view-part/555861/?ref=snap; Value: *; Purchase-URL: https://pricing.snapeda.com/search/part/ESP8266EX/?ref=eda; Price: None; Availability: Warning; MP: ESP8266EX; Package: VFQFN-32 Espressif Systems; Check_prices: https://www.snapeda.com/parts/ESP8266EX/Espressif%20Systems/view-part/555861/?ref=eda
U2.2 = W25Q16BVSSIG: Flash, pin, soic, flash, Memory, Semiconductors and Actives, serial, ic; MF: {'manufacturer': u'Winbond'}; MP: W25Q16BVSSIG; Availability: Unavailable; Value: *; Price: None; Package: None
Y1.2 = ABM3B-8.000MHZ-B2-T: Crystal 8MHz В±20ppm (Tol) В±50ppm (Stability) 18pF FUND 200Ohm 4-Pin CSMD T/R; MF: {'manufacturer': u'Abracon'}; Value: *; Price: None; Package: None; Availability: Unavailable; MP: ABM3B-8.000MHZ-B2-T
C3.2 C4.2 = GRM1885C2A150JA01J: SnapEDA_Link: https://www.snapeda.com/parts/GRM1885C2A150JA01J/Murata/view-part/1812122/?ref=snap; ChipDip_Link: https://www.chipdip.ru/product/grm1885c2a150j; HelpURL: https://static.chipdip.ru/lib/428/DOC005428493.pdf

## Nets that join several sheets
3.3ESP: ESP8266 (11 pins), sESP (11 pins)
5V: CAN_ESP (15 pins), ESP8266 (C2.1.1 D1.1.C U2.1.1 U2.1.3)
GND: CAN_ESP (43 pins), ESP8266 (25 pins), sESP (10 pins)
ADC: ESP8266 (U1.1.2), sESP (U1.2.6)
EN: CAN_ESP (DD1.0.20), ESP8266 (R3.1.1 U1.1.3), sESP (U1.2.7)
GPIO0: ESP8266 (J2.1.4 R1.1.1 T1.1.3 U1.1.18), sESP (U1.2.15)
GPIO2: ESP8266 (R2.1.1 R13.1.1 U1.1.17), sESP (U1.2.14)
GPIO4: ESP8266 (U1.1.19), sESP (U1.2.16)
GPIO5: ESP8266 (U1.1.20), sESP (U1.2.24)
GPIO12: ESP8266 (U1.1.6), sESP (U1.2.10)
GPIO13: ESP8266 (U1.1.7), sESP (U1.2.12)
GPIO14: ESP8266 (U1.1.5), sESP (U1.2.9)
GPIO15: ESP8266 (R5.1.1 U1.1.16), sESP (U1.2.13)
nRST: ESP8266 (C4.1.1 R4.1.1 T2.1.3 U1.1.1), sESP (U1.2.32)
RXD0: CAN_ESP (DD1.0.21), ESP8266 (J2.1.2 R9.1.1 U1.1.21), sESP (U1.2.25)
TXD0: CAN_ESP (DD1.0.22), ESP8266 (J2.1.3 R8.1.1 U1.1.22), sESP (U1.2.26)